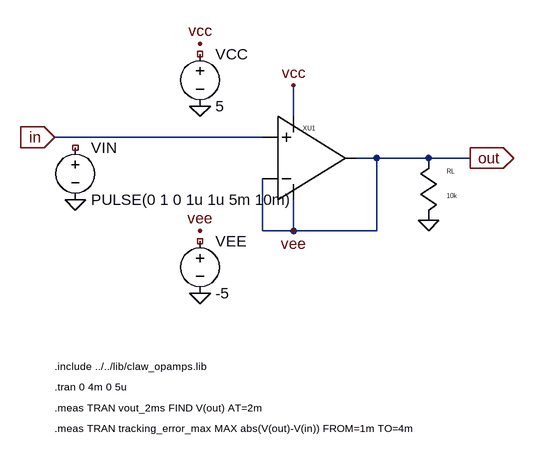
[diagram p0: schematic opamp_voltage_follower.asc]
opamp_voltage_follower.asc, the LTspice schematic file:
Version 4
SHEET 1 1200 823
WIRE 64 192 384 192
WIRE 528 224 704 224
WIRE 528 224 560 224
WIRE 560 224 560 336
WIRE 560 336 384 336
WIRE 384 336 384 256
WIRE 432 160 432 112
WIRE 432 288 432 336
SYMBOL voltage 96 192 R0
SYMATTR InstName VIN
SYMATTR Value PULSE(0 1 0 1u 1u 5m 10m)
SYMBOL voltage 288 48 R0
SYMATTR InstName VCC
SYMATTR Value 5
SYMBOL voltage 288 336 R0
SYMATTR InstName VEE
SYMATTR Value -5
SYMBOL opamp2 384 160 R0
SYMATTR InstName XU1
SYMATTR Value CLAW_IDEAL_OPAMP
SYMBOL res_v 640 224 R0
SYMATTR InstName RL
SYMATTR Value 10k
FLAG 64 192 in
IOPIN 64 192 In
FLAG 704 224 out
IOPIN 704 224 Out
FLAG 96 288 0
FLAG 640 320 0
FLAG 288 48 vcc
FLAG 288 144 0
FLAG 288 336 vee
FLAG 288 432 0
FLAG 432 112 vcc
FLAG 432 336 vee
TEXT 64 544 Left 1 !.include ../../lib/claw_opamps.lib
TEXT 64 576 Left 1 !.tran 0 4m 0 5u
TEXT 64 608 Left 1 !.meas TRAN vout_2ms FIND V(out) AT=2m
TEXT 64 640 Left 1 !.meas TRAN tracking_error_max MAX abs(V(out)-V(in)) FROM=1m TO=4m

The netlist it stands for:
* opamp_voltage_follower.asc
VIN NC_01 0 PULSE(0 1 0 1u 1u 5m 10m)
VCC NC_02 0 5
VEE NC_03 0 -5
XXU1 CLAW_IDEAL_OPAMP CLAW_IDEAL_OPAMP
RL vee 0 10k
.include ../../lib/claw_opamps.lib
.tran 0 4m 0 5u
.meas TRAN vout_2ms FIND V(out) AT=2m
.meas TRAN tracking_error_max MAX abs(V(out)-V(in)) FROM=1m TO=4m
.backanno
.end